# Altium project digital_watch.PrjPcb
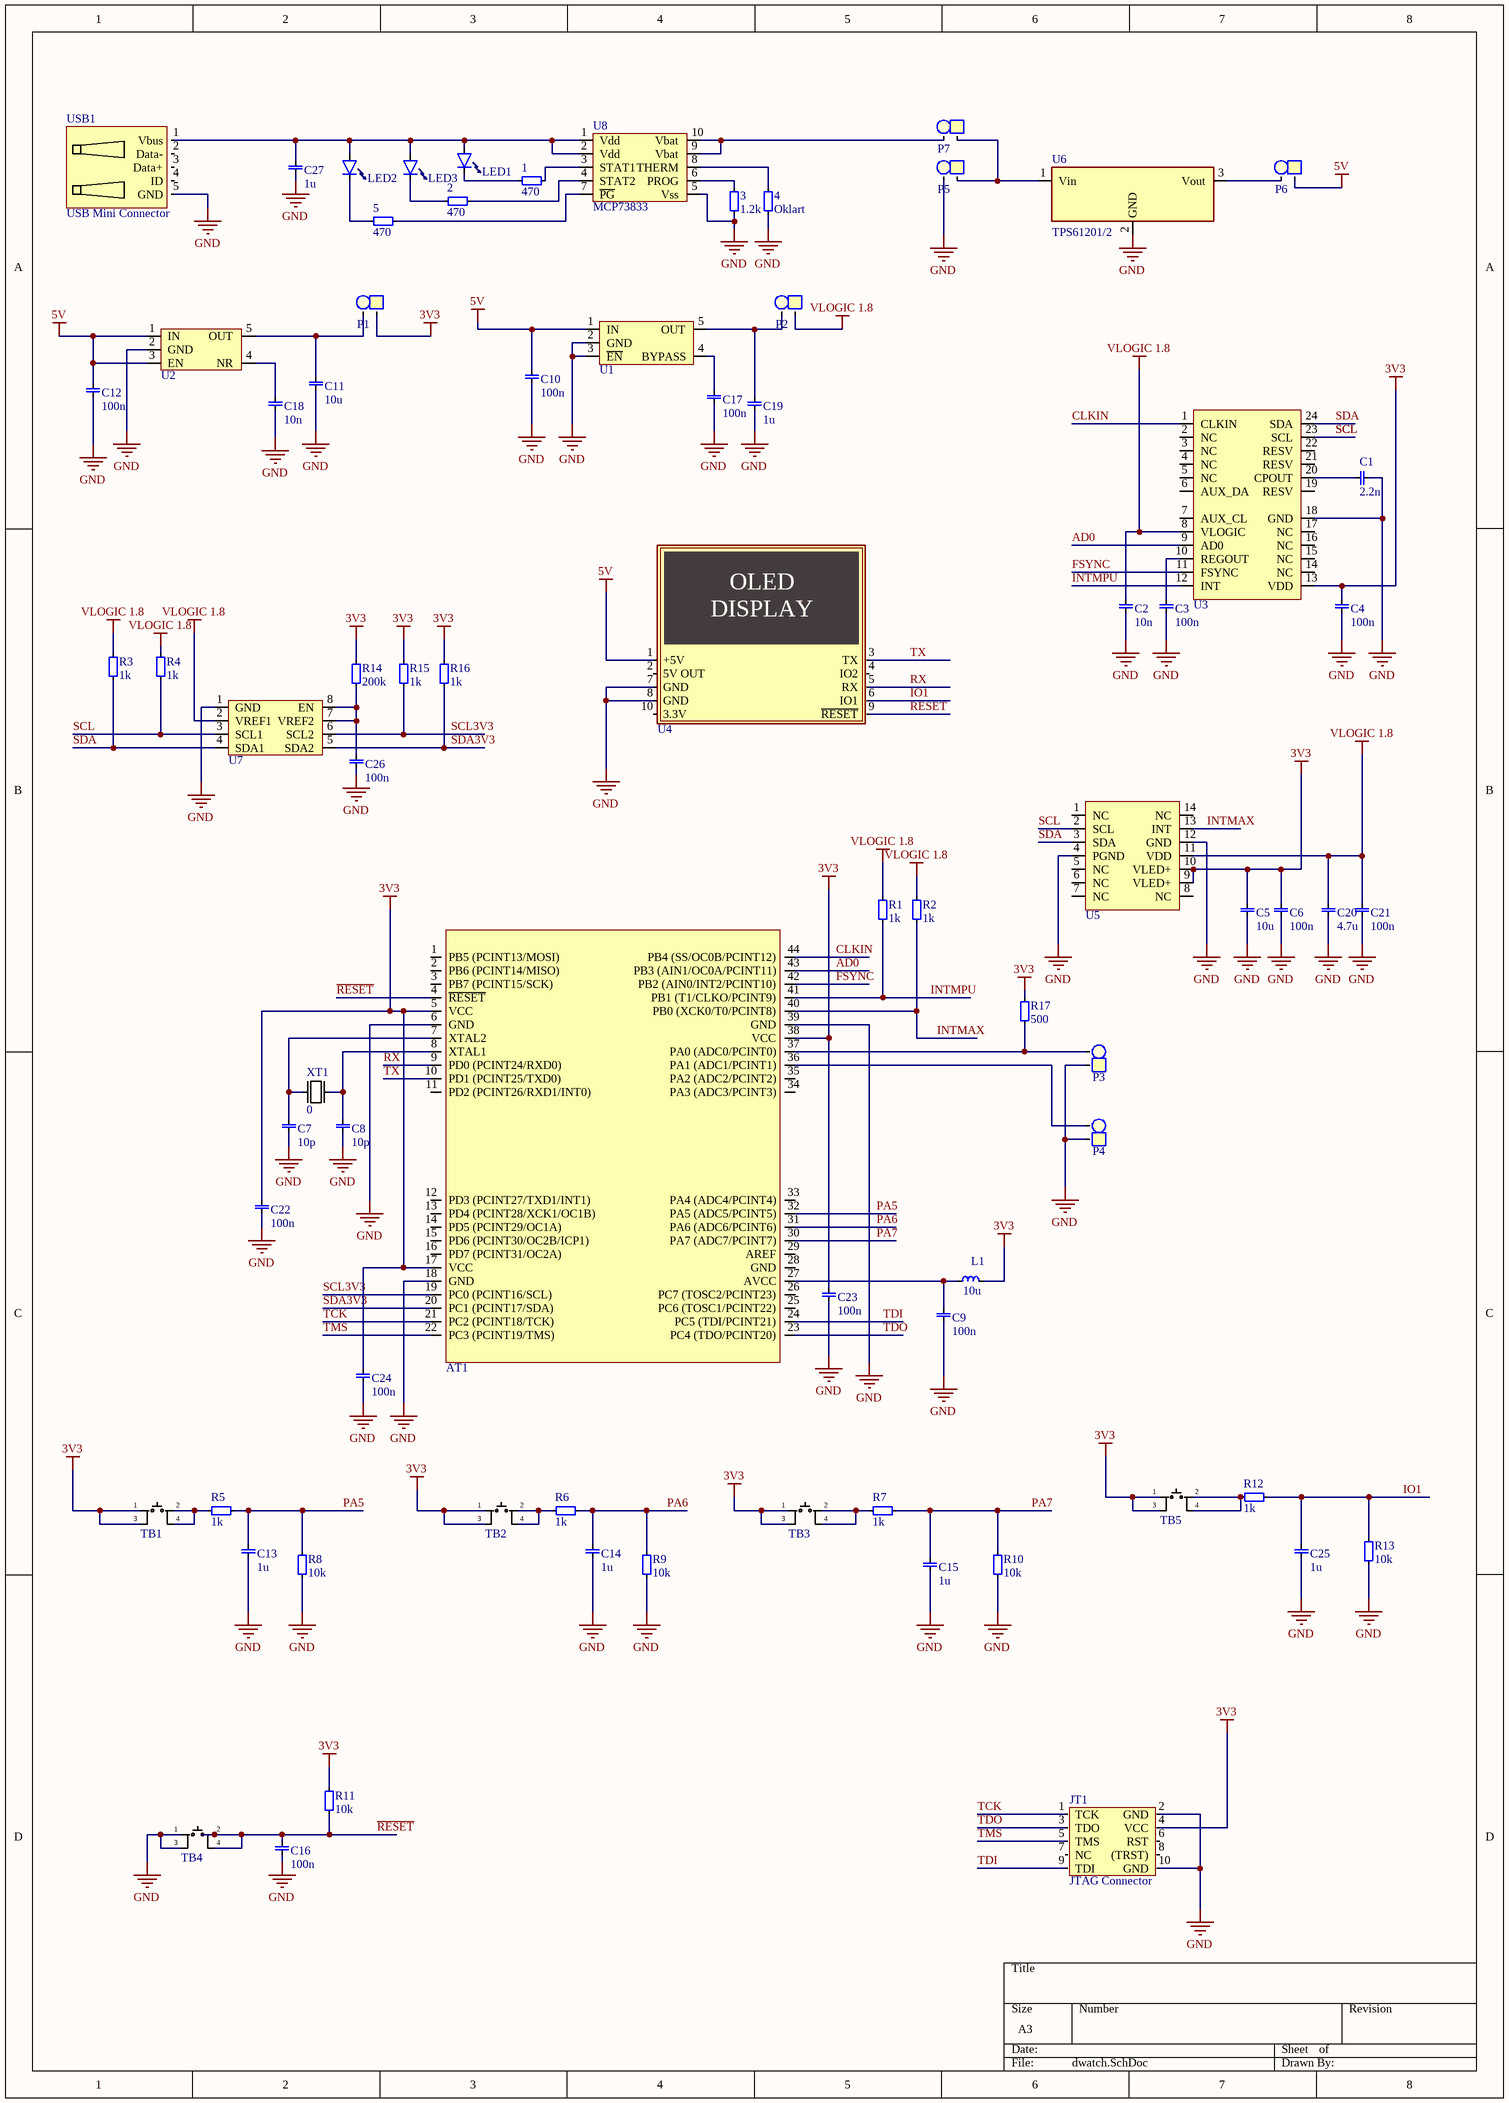
[diagram p0: dwatch.SchDoc]
1 sheet, 77 parts. Net scope: global (net labels, ports and power ports of the same name join across sheets).
Board file: dwatch.PcbDoc

## Sheet dwatch.SchDoc
size A3 portrait

### Parts
1  value 470  [1206]  (hidden comment: 1206, resistor)
2  value 470  [1206]  (hidden comment: 1206, resistor)
3  value 1.2k  [1206]  (hidden comment: 1206, resistor)
4  value Oklart  [1206]  (hidden comment: 1206, resistor)
5  value 470  [1206]  (hidden comment: 1206, resistor)
AT1  ATmega644PA  [TQFP-44]  (value not drawn)
C1  value 2.2n  [1206, capasitor]  (hidden comment: 1206, capacitor)
C2  value 10n  [1206, capasitor]  (hidden comment: 1206, capacitor)
C3  value 100n  [1206, capasitor]  (hidden comment: 1206, capacitor)
C4  value 100n  [1206, capasitor]  (hidden comment: 1206, capacitor)
C5  value 10u  [1206, capasitor]  (hidden comment: 1206, capacitor)
C6  value 100n  [1206, capasitor]  (hidden comment: 1206, capacitor)
C7  value 10p  [1206, capasitor]  (hidden comment: 1206, capacitor)
C8  value 10p  [1206, capasitor]  (hidden comment: 1206, capacitor)
C9  value 100n  [1206, capasitor]  (hidden comment: 1206, capacitor)
C10  value 100n  [1206, capasitor]  (hidden comment: 1206, capacitor)
C11  value 10u  [1206, capasitor]  (hidden comment: 1206, capacitor)
C12  value 100n  [1206, capasitor]  (hidden comment: 1206, capacitor)
C13  value 1u  [1206, capasitor]  (hidden comment: 1206, capacitor)
C14  value 1u  [1206, capasitor]  (hidden comment: 1206, capacitor)
C15  value 1u  [1206, capasitor]  (hidden comment: 1206, capacitor)
C16  value 100n  [1206, capasitor]  (hidden comment: 1206, capacitor)
C17  value 100n  [1206, capasitor]  (hidden comment: 1206, capacitor)
C18  value 10n  [1206, capasitor]  (hidden comment: 1206, capacitor)
C19  value 1u  [1206, capasitor]  (hidden comment: 1206, capacitor)
C20  value 4.7u  [1206, capasitor]  (hidden comment: 1206, capacitor)
C21  value 100n  [1206, capasitor]  (hidden comment: 1206, capacitor)
C22  value 100n  [1206, capasitor]  (hidden comment: 1206, capacitor)
C23  value 100n  [1206, capasitor]  (hidden comment: 1206, capacitor)
C24  value 100n  [1206, capasitor]  (hidden comment: 1206, capacitor)
C25  value 1u  [1206, capasitor]  (hidden comment: 1206, capacitor)
C26  value 100n  [1206, capasitor]  (hidden comment: 1206, capacitor)
C27  value 1u  [1206, capasitor]  (hidden comment: 1206, capacitor)
JT1  JTAG Connector  [Atmel_JTAG]
L1  value 10u  [1812, coil]  (hidden comment: Coil)
LED1  0805, LED  [0805_led]  (value not drawn)
LED2  0805, LED  [0805_led]  (value not drawn)
LED3  0805, LED  [0805_led]  (value not drawn)
P1  1x2 Pin Header  [1x2HEADER]  (value not drawn)
P2  1x2 Pin Header  [1x2HEADER]  (value not drawn)
P3  1x2 Pin Header  [1x2HEADER]  (value not drawn)
P4  1x2 Pin Header  [1x2HEADER]  (value not drawn)
P5  1x2 Pin Header  [1x2HEADER]  (value not drawn)
P6  1x2 Pin Header  [1x2HEADER]  (value not drawn)
P7  1x2 Pin Header  [1x2HEADER]  (value not drawn)
R1  value 1k  [1206]  (hidden comment: 1206, resistor)
R2  value 1k  [1206]  (hidden comment: 1206, resistor)
R3  value 1k  [1206]  (hidden comment: 1206, resistor)
R4  value 1k  [1206]  (hidden comment: 1206, resistor)
R5  value 1k  [1206]  (hidden comment: 1206, resistor)
R6  value 1k  [1206]  (hidden comment: 1206, resistor)
R7  value 1k  [1206]  (hidden comment: 1206, resistor)
R8  value 10k  [1206]  (hidden comment: 1206, resistor)
R9  value 10k  [1206]  (hidden comment: 1206, resistor)
R10  value 10k  [1206]  (hidden comment: 1206, resistor)
R11  value 10k  [1206]  (hidden comment: 1206, resistor)
R12  value 1k  [1206]  (hidden comment: 1206, resistor)
R13  value 10k  [1206]  (hidden comment: 1206, resistor)
R14  value 200k  [1206]  (hidden comment: 1206, resistor)
R15  value 1k  [1206]  (hidden comment: 1206, resistor)
R16  value 1k  [1206]  (hidden comment: 1206, resistor)
R17  value 500  [1206]  (hidden comment: 1206, resistor)
TB1  Tactile Button  [Button smd]  (value not drawn)
TB2  Tactile Button  [Button smd]  (value not drawn)
TB3  Tactile Button  [Button smd]  (value not drawn)
TB4  Tactile Button  [Button smd]  (value not drawn)
TB5  Tactile Button  [Button smd]  (value not drawn)
U1  TPS79118DBVR  [SOT23-5]  (value not drawn)
U2  TPS79333DBVRG4  [SOT23-5]  (value not drawn)
U3  MPU-6050  [MPU6050_QNF24]  (value not drawn)
U4  uOLED-128G2  [uOLED-128G2]  (value not drawn)
U5  MAX30101  [MAX30101EFD]  (value not drawn)
U6  TPS61201/2  [tps61201_2]
U7  PCA9306  [PCA9306]  (value not drawn)
U8  MCP73833  [MCP73833]
USB1  USB Mini Connector  [USB Mini TH]
XT1  value 0  [XTAL_SMD_LP]  (hidden comment: XTAL TXC 7A)

### Nets
3V3: AT1.5(VCC) AT1.17(VCC) AT1.38(VCC) C4.1 C5.1 C6.1 C22.1 C23.1 C24.1 JT1.4(VCC) L1.1 P1.1 R11.0 R14.0 R15.0 R16.0 R17.0 TB1.1 TB1.3 TB2.1 TB2.3 TB3.1 TB3.3 TB5.1 TB5.3 U3.13(VDD) U5.9(VLED+) U5.10(VLED+)
5V: C10.1 C12.1 P6.1 U1.1(IN) U2.1(IN) U2.3(EN) U4.1(+5V)
GND: 3.1 4.1 AT1.6(GND) AT1.18(GND) AT1.39(GND) C1.1 C2.0 C3.0 C4.0 C5.0 C6.0 C7.0 C8.0 C9.0 C10.0 C11.0 C12.0 C13.0 C14.0 C15.0 C16.0 C17.0 C18.0 C19.0 C20.0 C21.0 C22.0 C23.0 C24.0 C25.0 C26.0 C27.0 JT1.2(GND) JT1.10(GND) P3.1 P4.1 P5.2 R8.1 R9.1 R10.1 R13.1 TB4.1 TB4.3 U1.2(GND) U1.3(~{EN}) U2.2(GND) U3.18(GND) U4.7(GND) U4.8(GND) U5.4(PGND) U5.12(GND) U6.2(GND) U7.1(GND) U8.5(Vss) USB1.5(GND)
VLOGIC 1.8: C2.1 C20.1 C21.1 P2.1 R1.0 R2.0 R3.0 R4.0 U3.8(VLOGIC) U5.11(VDD) U7.2(VREF1)
~{RESET}: AT1.4(~{RESET}) C16.1 R11.1 TB4.2 TB4.4 U4.9(~{RESET})
AD0: AT1.43(PB3_(AIN1/OC0A/PCINT11)) U3.9(AD0)
CLKIN: AT1.44(PB4_(SS/OC0B/PCINT12)) U3.1(CLKIN)
FSYNC: AT1.42(PB2_(AIN0/INT2/PCINT10)) U3.11(FSYNC)
INTMAX: AT1.40(PB0_(XCK0/T0/PCINT8)) R2.1 U5.13(INT)
INTMPU: AT1.41(PB1_(T1/CLKO/PCINT9)) R1.1 U3.12(INT)
IO1: C25.1 R12.0 R13.0 U4.6(IO1)
PA5: AT1.32(PA5_(ADC5/PCINT5)) C13.1 R5.0 R8.0
PA6: AT1.31(PA6_(ADC6/PCINT6)) C14.1 R6.0 R9.0
PA7: AT1.30(PA7_(ADC7/PCINT7)) C15.1 R7.0 R10.0
RX: AT1.9(PD0_(PCINT24/RXD0)) U4.5(RX)
SCL: R4.1 U3.23(SCL) U5.2(SCL) U7.3(SCL1)
SCL3V3: AT1.19(PC0_(PCINT16/SCL)) R15.1 U7.6(SCL2)
SDA: R3.1 U3.24(SDA) U5.3(SDA) U7.4(SDA1)
SDA3V3: AT1.20(PC1_(PCINT17/SDA)) R16.1 U7.5(SDA2)
TCK: AT1.21(PC2_(PCINT18/TCK)) JT1.1(TCK)
TDI: AT1.24(PC5_(TDI/PCINT21)) JT1.9(TDI)
TDO: AT1.23(PC4_(TDO/PCINT20)) JT1.3(TDO)
TMS: AT1.22(PC3_(PCINT19/TMS)) JT1.5(TMS)
TX: AT1.10(PD1_(PCINT25/TXD0)) U4.3(TX)
Net1_0: 1.0 U8.3(STAT1)
Net1_1: 1.1 LED1.0(Cathode)
Net2_0: 2.0 U8.4(STAT2)
Net2_1: 2.1 LED3.0(Cathode)
Net3_0: 3.0 U8.6(PROG)
Net4_0: 4.0 U8.8(THERM)
Net5_0: 5.0 U8.7(~{PG})
Net5_1: 5.1 LED2.0(Cathode)
NetAT1_7: AT1.7(XTAL2) C7.1 XT1.1
NetAT1_8: AT1.8(XTAL1) C8.1 XT1.2
NetAT1_27: AT1.27(AVCC) C9.1 L1.2
NetAT1_36: AT1.36(PA1_(ADC1/PCINT1)) P4.2
NetAT1_37: AT1.37(PA0_(ADC0/PCINT0)) P3.2 R17.1
NetC1_0: C1.0 U3.20(CPOUT)
NetC3_1: C3.1 U3.10(REGOUT)
NetC11_1: C11.1 P1.2 U2.5(OUT)
NetC17_1: C17.1 U1.4(BYPASS)
NetC18_1: C18.1 U2.4(NR)
NetC19_1: C19.1 P2.2 U1.5(OUT)
NetC26_1: C26.1 R14.1 U7.7(VREF2) U7.8(EN)
NetC27_1: C27.1 LED1.1 LED2.1 LED3.1 U8.1(Vdd) U8.2(Vdd) USB1.1(Vbus)
NetP5_1: P5.1 P7.1 U6.1(Vin)
NetP6_2: P6.2 U6.3(Vout)
NetP7_2: P7.2 U8.9(Vbat) U8.10(Vbat)
NetR5_1: R5.1 TB1.2 TB1.4
NetR6_1: R6.1 TB2.2 TB2.4
NetR7_1: R7.1 TB3.2 TB3.4
NetR12_1: R12.1 TB5.2 TB5.4

Not connected (* = marked no-connect by the designer): AT1 1(PB5_(PCINT13/MOSI)) 2(PB6_(PCINT14/MISO)) 3(PB7_(PCINT15/SCK)) 11(PD2_(PCINT26/RXD1/INT0)) 12(PD3_(PCINT27/TXD1/INT1)) 13(PD4_(PCINT28/XCK1/OC1B)) 14(PD5_(PCINT29/OC1A)) 15(PD6_(PCINT30/OC2B/ICP1)) 16(PD7_(PCINT31/OC2A)) 25(PC6_(TOSC1/PCINT22)) 26(PC7_(TOSC2/PCINT23)) 28(GND) 29(AREF) 33(PA4_(ADC4/PCINT4)) 34(PA3_(ADC3/PCINT3)) 35(PA2_(ADC2/PCINT2)); JT1 6(RST) 7(NC) 8((TRST)); U3 2(NC) 3(NC) 4(NC) 5(NC) 6(AUX_DA) 7(AUX_CL) 14(NC) 15(NC) 16(NC) 17(NC) 19(RESV) 21(RESV) 22(RESV); U4 2(5V_OUT) 4(IO2) 10(3.3V); U5 1(NC) 5(NC) 6(NC) 7(NC) 8(NC) 14(NC); USB1 2(Data-) 3(Data+) 4(ID)

### Notes on the sheet
- (in symbol uOLED-128G2) OLED; DISPLAY

### Library data of the parts
1-5 R1-R17 = 1206, resistor: Resistor
  1 2 5: Digikey: P470ECT-ND
  3: Digikey: RHM1.2KICT-ND
  R1-R7 R12 R15 R16: Digikey: RNCP1206FTD1K00CT-ND
  R8-R11 R13: Digikey: RNCP1206FTD10K0CT-ND
  R14: Digikey: P200KBCCT-ND
  R17: Digikey: 541-3306-1-ND
AT1 = ATmega644PA: ATmega644PA - Small but big and PicoPower; Farnell: 2484915; Value: ATmega644PA
JT1 = Atmel JTAG: Atmel JTAG Connector
LED1-LED3 = 0805, LED: Value: 0805 LED; Digikey: 67-1553-1-ND
P1-P7 = 1x2 Pin Header: 2.54 mm, TH; Value: 1x2 Pin Header
TB1-TB5 = Button SMD: Tactile Switch Small Low; ELFA: 110-87-406; Value: Button SMD
U4 = uOLED-128G2: Value: OLED-Display; Farnell: 2316038
XT1 = XTAL TXC 7A: 16 MHz, SMD, 5mm x 3,2mm, 30 ppm; Farnell: 1841946
C1-C27 = 1206, capacitor
  C1: Digikey: 1608-1486-1-ND
  C2 C18: Digikey: 478-1542-1-ND
  C3 C4 C6 C9 C10 C12 C16 C17 C21-C24 C26: Digikey: 1276-1017-1-ND
  C5 C11: Digikey: 1276-1079-1-ND
  C7 C8: Digikey: 732-7872-1-ND
  C13-C15 C19 C25 C27: Digikey: 478-2576-1-ND
  C20: Digikey: 478-5996-1-ND
L1 = Coil: Digikey: 495-1754-1-ND
U1 = TPS79118DBVR: Digikey: 296-11865-1-ND
U2 = TPS79333DBVRG4: Digikey: 2156-TPS79333DBVRG4Q1-ND
U3 = MPU-6050: Digikey: 1428-1007-1-ND
U5 = MAX30101: Digikey: MAX30102EFD+-ND
U6 = TPS61201/2: Digikey: 2156-TPS61202DSCR-ND
U7 = PCA9306: digikey: 568-4215-1-ND
U8 = MCP73833: Digikey: MCP73833-NVI/UN-ND
USB1 = USB Mini Connector: Value: USB Mini Connector; Farnell: 1125348